# EAGLE design MAM_GND_V4 (EAGLE 9.4.2)
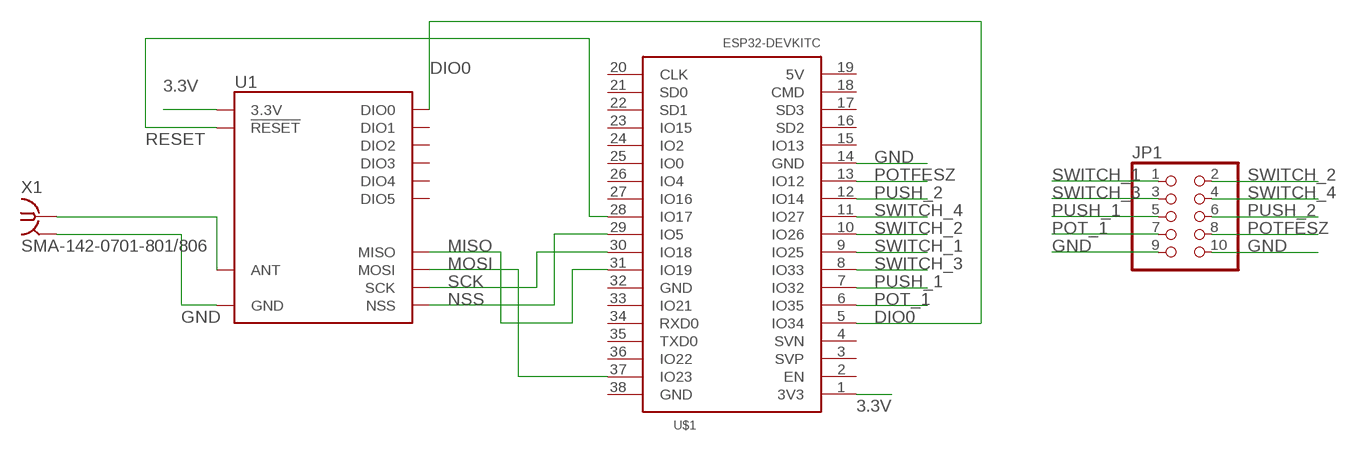
[diagram p0: schematic, sheet 1]

## Parts
JP1  PINHD-2X5  [2X05]
U1  RFM95W  [RFM95/96/97/98W]
U$1  ESP32DEVKITC  [ESP32-DEVKITC]
X1  SMA-142-0701-801/806  [J502-ND-142-0701-801/806]

## Nets
3.3V: U1.3.3V U$1.1(3V3)
DIO0: U1.DIO0 U$1.5(IO34)
GND: JP1.9 JP1.10 U1.GND@1(GND) U1.GND@2(GND) U1.GND@3(GND) U$1.14(GND) X1.G@1 X1.G@2 X1.G@3 X1.G@4
MISO: U1.MISO U$1.31(IO19)
MOSI: U1.MOSI U$1.37(IO23)
N$6: U1.ANT X1.1
NSS: U1.NSS U$1.29(IO5)
POT_1: JP1.7 U$1.6(IO35)
POTFESZ: JP1.8 U$1.13(IO12)
PUSH_1: JP1.5 U$1.7(IO32)
PUSH_2: JP1.6 U$1.12(IO14)
RESET: U1.!RESET U$1.28(IO17)
SCK: U1.SCK U$1.30(IO18)
SWITCH_1: JP1.1 U$1.9(IO25)
SWITCH_2: JP1.2 U$1.10(IO26)
SWITCH_3: JP1.3 U$1.8(IO33)
SWITCH_4: JP1.4 U$1.11(IO27)
Unconnected: U1.DIO1 U1.DIO2 U1.DIO3 U1.DIO4 U1.DIO5 U$1.2(EN) U$1.3(SVP) U$1.4(SVN) U$1.15(IO13) U$1.16(SD2) U$1.17(SD3) U$1.18(CMD) U$1.19(5V) U$1.20(CLK) U$1.21(SD0) U$1.22(SD1) U$1.23(IO15) U$1.24(IO2) U$1.25(IO0) U$1.26(IO4) U$1.27(IO16) U$1.32(GND) U$1.33(IO21) U$1.34(RXD0) U$1.35(TXD0) U$1.36(IO22) U$1.38(GND)

## Library data of the parts
JP1 = pinhead:PINHD-2X5: PIN HEADER
U1 = SparkFun-RF:RFM95W: RFM95/96/97/98 The RFM95/96/97/98(W) transceivers feature the LoRaTM long range modem that provides ultra-long range spread spectrum communication and high interference immunity whilst minimising current consumption. These devices also support high performance (G)FSK modes for systems including WMBus, IEEE802.15.4g. The RFM95/96/97/98(W) deliver exceptional phase noise, selectivity, receiver linearity and IIP3 for significantly lower current consumption than competing devices Datasheet <http://www.hoperf.com/upload/rf/RFM95_96_97_98W.pdf>; PROD_ID: IC-13959
U$1 = ESP32-DEVKITC:ESP32DEVKITC
X1 = con-coax:SMA-: SMA 50 Ohm End Launch Jack Receptacle - Round Contact Johnson Components Source: www.johnsoncomponents.com .. J502-ND.pdf; MF: JOHNSON COMPONENTS; MPN: 142-0701-801; OC_FARNELL: 1608592; OC_NEWARK: 90F2624

## Board
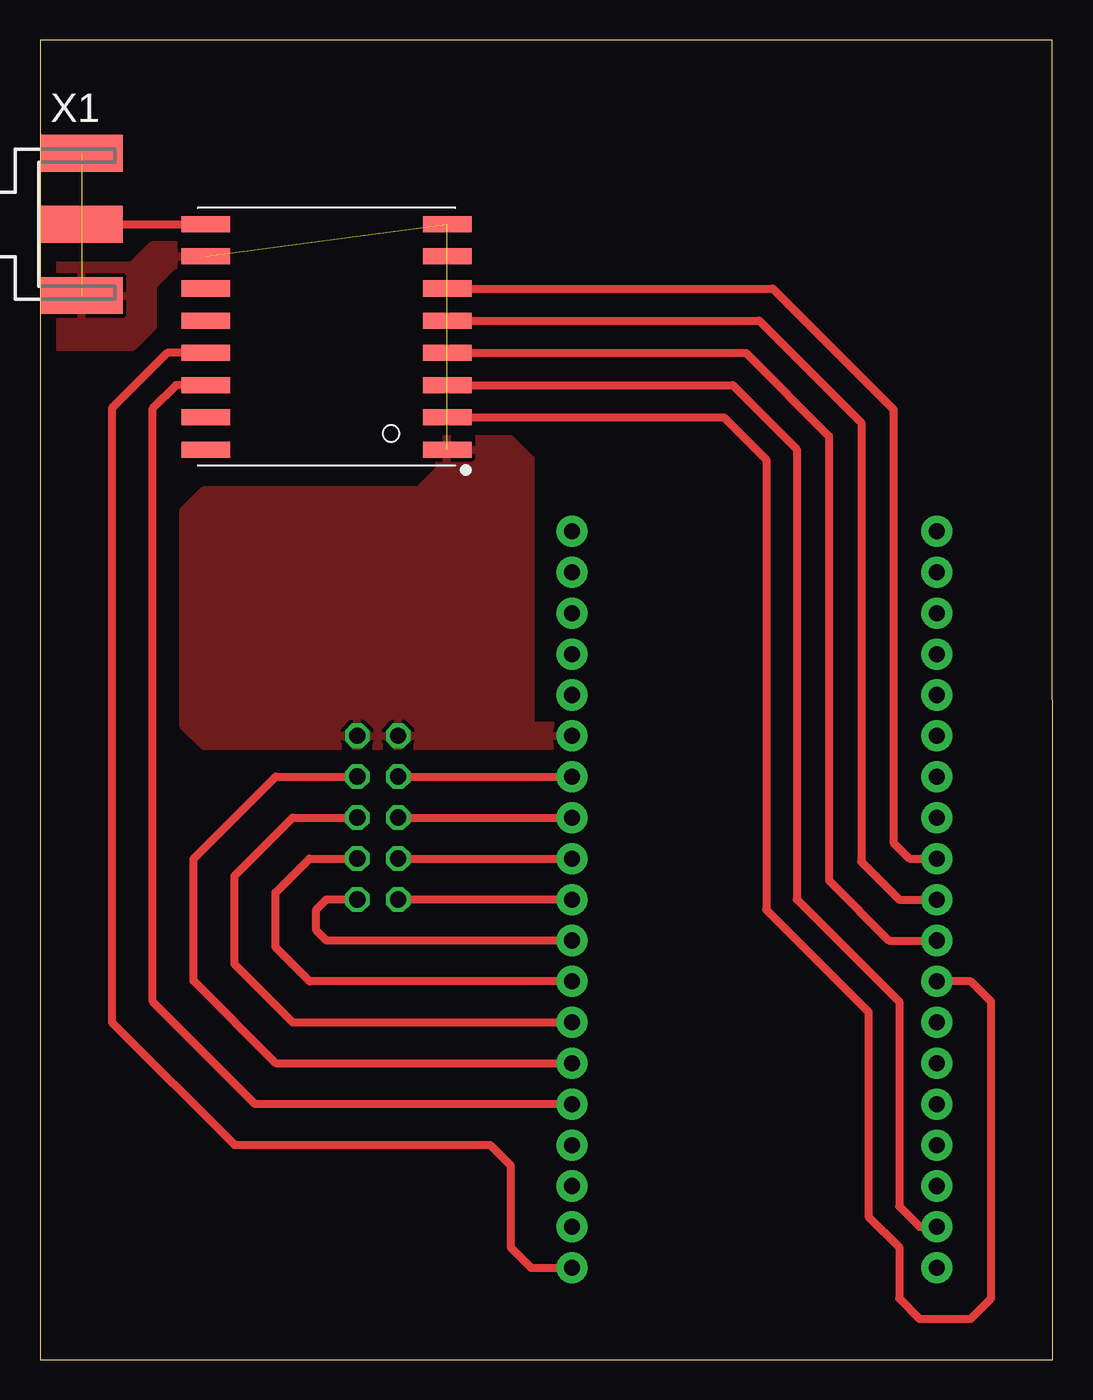
[diagram p1: board, top side]
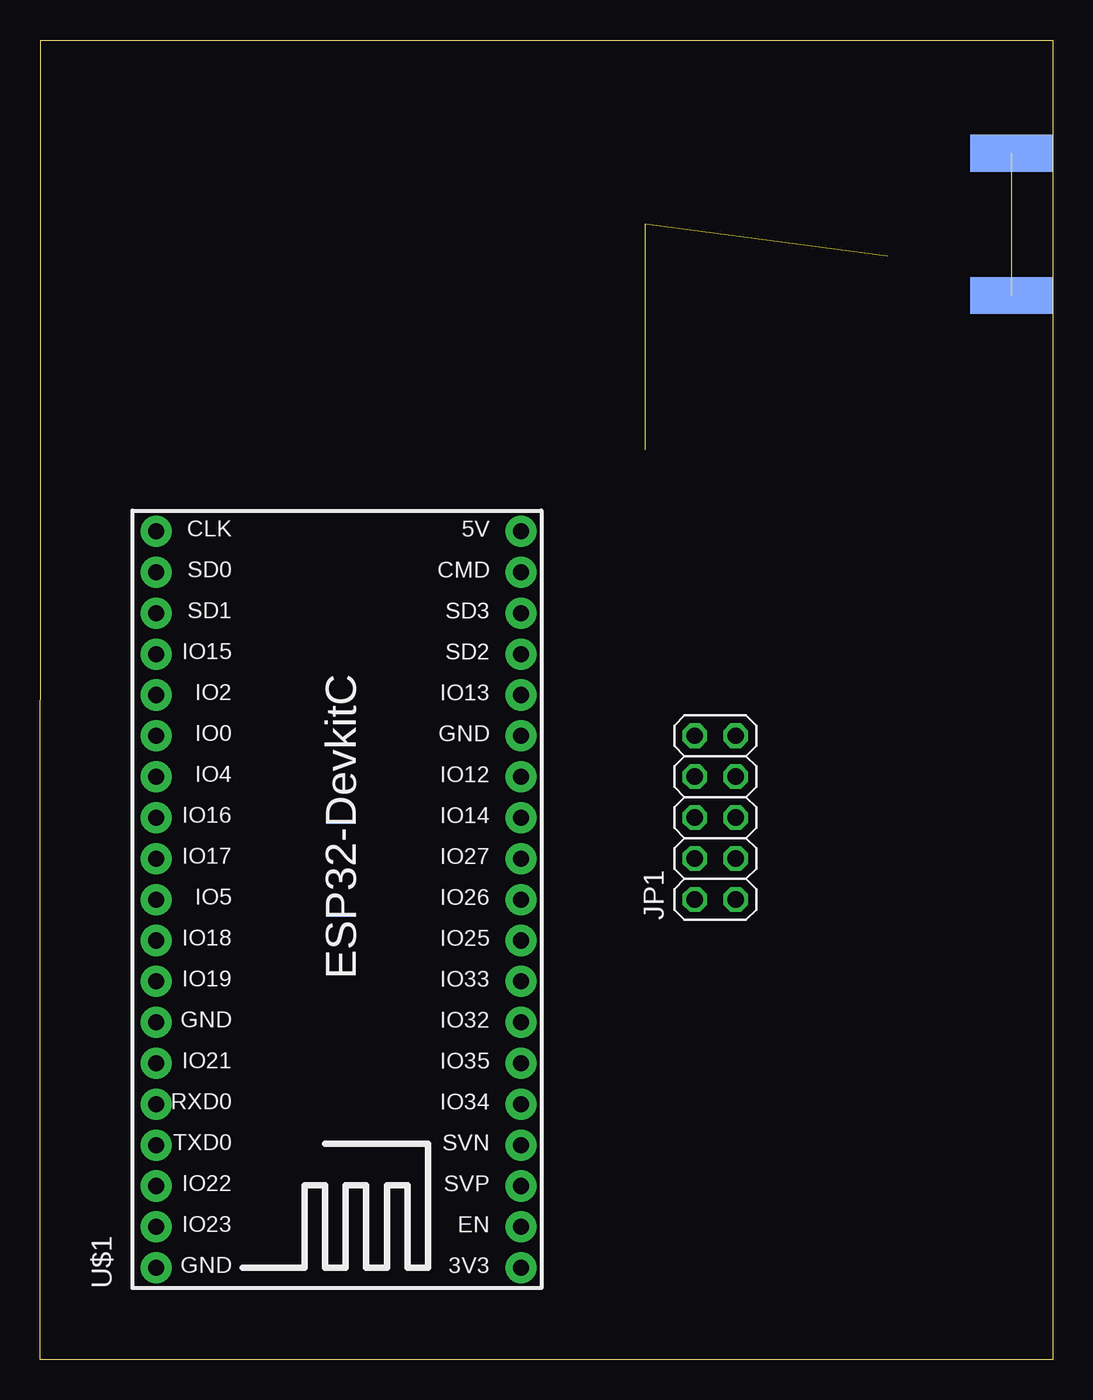
[diagram p2: board, bottom side, seen from below]

Size 62.88 x 81.91 mm. Coordinates in mm from the lower left corner, seen from the top.
Outline: 0,0 62.88,0.01 62.85,81.91 0,81.91 0,0
Copper layers (1*16): Top 0.035mm / dielectric 1.5mm / Bottom 0.035mm
Design rules "default": minimum track width 6mil, minimum drill 0.35mm, track to track 6mil, track to pad 6mil, pad to pad 6mil, via to via 6mil, smd to smd 6mil, copper to edge 40mil, drill to drill 6mil, minimum pad ring 10mil, minimum via ring 8mil, stop-mask expansion 4mil, vias tented up to drill 0mil, thermal gap 10mil

### Footprints (pad centres in the part's own frame; a part is rotated, then mirrored left to right if it is on the bottom)
2X05 = drill 1.016 octagon: 1 -5.08,-1.27; 2 -5.08,1.27; 3 -2.54,-1.27; 4 -2.54,1.27; 5 0,-1.27; 6 0,1.27; 7 2.54,-1.27; 8 2.54,1.27; 9 5.08,-1.27; 10 5.08,1.27
RFM95/96/97/98W = smd 3 x 1: 3.3V 7.5,1; !RESET -7.5,-3; ANT 7.5,-7; DIO0 7.5,3; DIO1 7.5,5; DIO2 7.5,7; DIO3 7.5,-3; DIO4 7.5,-1; DIO5 -7.5,-5; GND@1 -7.5,7; GND@2 -7.5,-7; GND@3 7.5,-5; MISO -7.5,5; MOSI -7.5,3; NSS -7.5,-1; SCK -7.5,1
ESP32-DEVKITC = drill 1 pad 1.93: 1 -22.87,-11.42; 2 -20.33,-11.42; 3 -17.79,-11.42; 4 -15.25,-11.42; 5 -12.71,-11.42; 6 -10.17,-11.42; 7 -7.63,-11.42; 8 -5.09,-11.42; 9 -2.55,-11.42; 10 -0.01,-11.42; 11 2.53,-11.42; 12 5.07,-11.42; 13 7.61,-11.42; 14 10.15,-11.42; 15 12.69,-11.42; 16 15.23,-11.42; 17 17.77,-11.42; 18 20.31,-11.42; 19 22.85,-11.42; 20 22.85,11.23; 21 20.31,11.23; 22 17.77,11.23; 23 15.23,11.23; 24 12.69,11.23; 25 10.15,11.23; 26 7.61,11.23; 27 5.07,11.23; 28 2.53,11.23; 29 -0.01,11.23; 30 -2.55,11.23; 31 -5.09,11.23; 32 -7.63,11.23; 33 -10.17,11.23; 34 -12.71,11.23; 35 -15.25,11.23; 36 -17.79,11.23; 37 -20.33,11.23; 38 -22.87,11.23
J502-ND-142-0701-801/806 = smd 5.08 x 2.286: 1 2.565,0; G@1 2.565,4.42; G@2 2.565,-4.42 | smd 5.08 x 2.286 bottom: G@3 2.565,4.42; G@4 2.565,-4.42

### Placement (x,y rotation side)
JP1  20.95,33.66 90 bottom
U1  17.78,63.5 180 top
U$1  44.45,28.57 90 bottom
X1  0,70.48 0 top

### Tracks (layer width: path | path; a pad name or v marks a point on that pad's centre or on a via)
3.3V
  Top 0.508: U1.3.3V 7.89,62.5 4.45,59.05 4.45,20.95 12.06,13.34 27.94,13.34 29.21,12.06 29.21,6.99 30.49,5.71 U$1.1
DIO0
  Top 0.508: U1.DIO0 8.43,60.5 6.99,59.05 6.99,22.23 13.35,15.87 U$1.5
GND  (5 unrouted)
  pour Top: 10.16,38.1 33.02,38.1 33.02,39.37 30.48,39.37 30.48,55.88 29.21,57.15 24.77,57.15 24.77,55.24 23.5,53.98 10.16,53.98 8.89,52.7 8.89,39.37
  pour Top: 0,62.87 0,67.94 5.71,67.94 6.99,69.22 9.53,69.22 9.53,67.94 8.26,67.94 6.99,66.67 6.99,64.14 5.71,62.87
MISO
  Top 0.508: U1.MISO 42.47,58.5 45.09,55.88 45.09,27.94 51.44,21.59 51.44,8.89 53.34,6.99 53.34,3.81 54.61,2.54 57.78,2.54 59.05,3.81 59.05,22.23 57.78,23.5 55.69,23.5 U$1.31
MOSI
  Top 0.508: U1.MOSI 43.01,60.5 46.99,56.52 46.99,28.57 53.34,22.23 53.34,9.53 54.62,8.24 U$1.37
N$6
  Top 0.508: X1.1 10.27,70.48 U1.ANT
NSS
  Top 0.508: U1.NSS 44.66,64.5 50.99,58.17 50.99,30.93 53.35,28.57 U$1.29
POT_1
  Top 0.508: JP1.7 14.62,36.2 9.53,31.1 9.53,23.51 14.63,18.41 U$1.6
POTFESZ
  Top 0.508: JP1.8 U$1.13
PUSH_1
  Top 0.508: JP1.5 15.68,33.66 12.06,30.04 12.06,24.57 15.69,20.95 U$1.7
PUSH_2
  Top 0.508: JP1.6 33.02,33.66 U$1.12
RESET
  Top 0.508: U1.!RESET 45.49,66.5 52.99,59 52.99,32.1 53.98,31.11 U$1.28
SCK
  Top 0.508: U1.SCK 43.83,62.5 48.99,57.34 48.99,29.75 52.72,26.02 U$1.30
SWITCH_1
  Top 0.508: JP1.1 17.78,28.57 17.14,27.94 17.14,26.67 17.79,26.02 U$1.9
SWITCH_2
  Top 0.508: JP1.2 33.02,28.57 U$1.10
SWITCH_3
  Top 0.508: JP1.3 16.73,31.11 14.61,28.99 14.61,25.62 16.74,23.48 U$1.8
SWITCH_4
  Top 0.508: JP1.4 U$1.11